# Altium schematic sheet uController.SchDoc
size A3; SheetNumber: 3; SheetTotal: 5
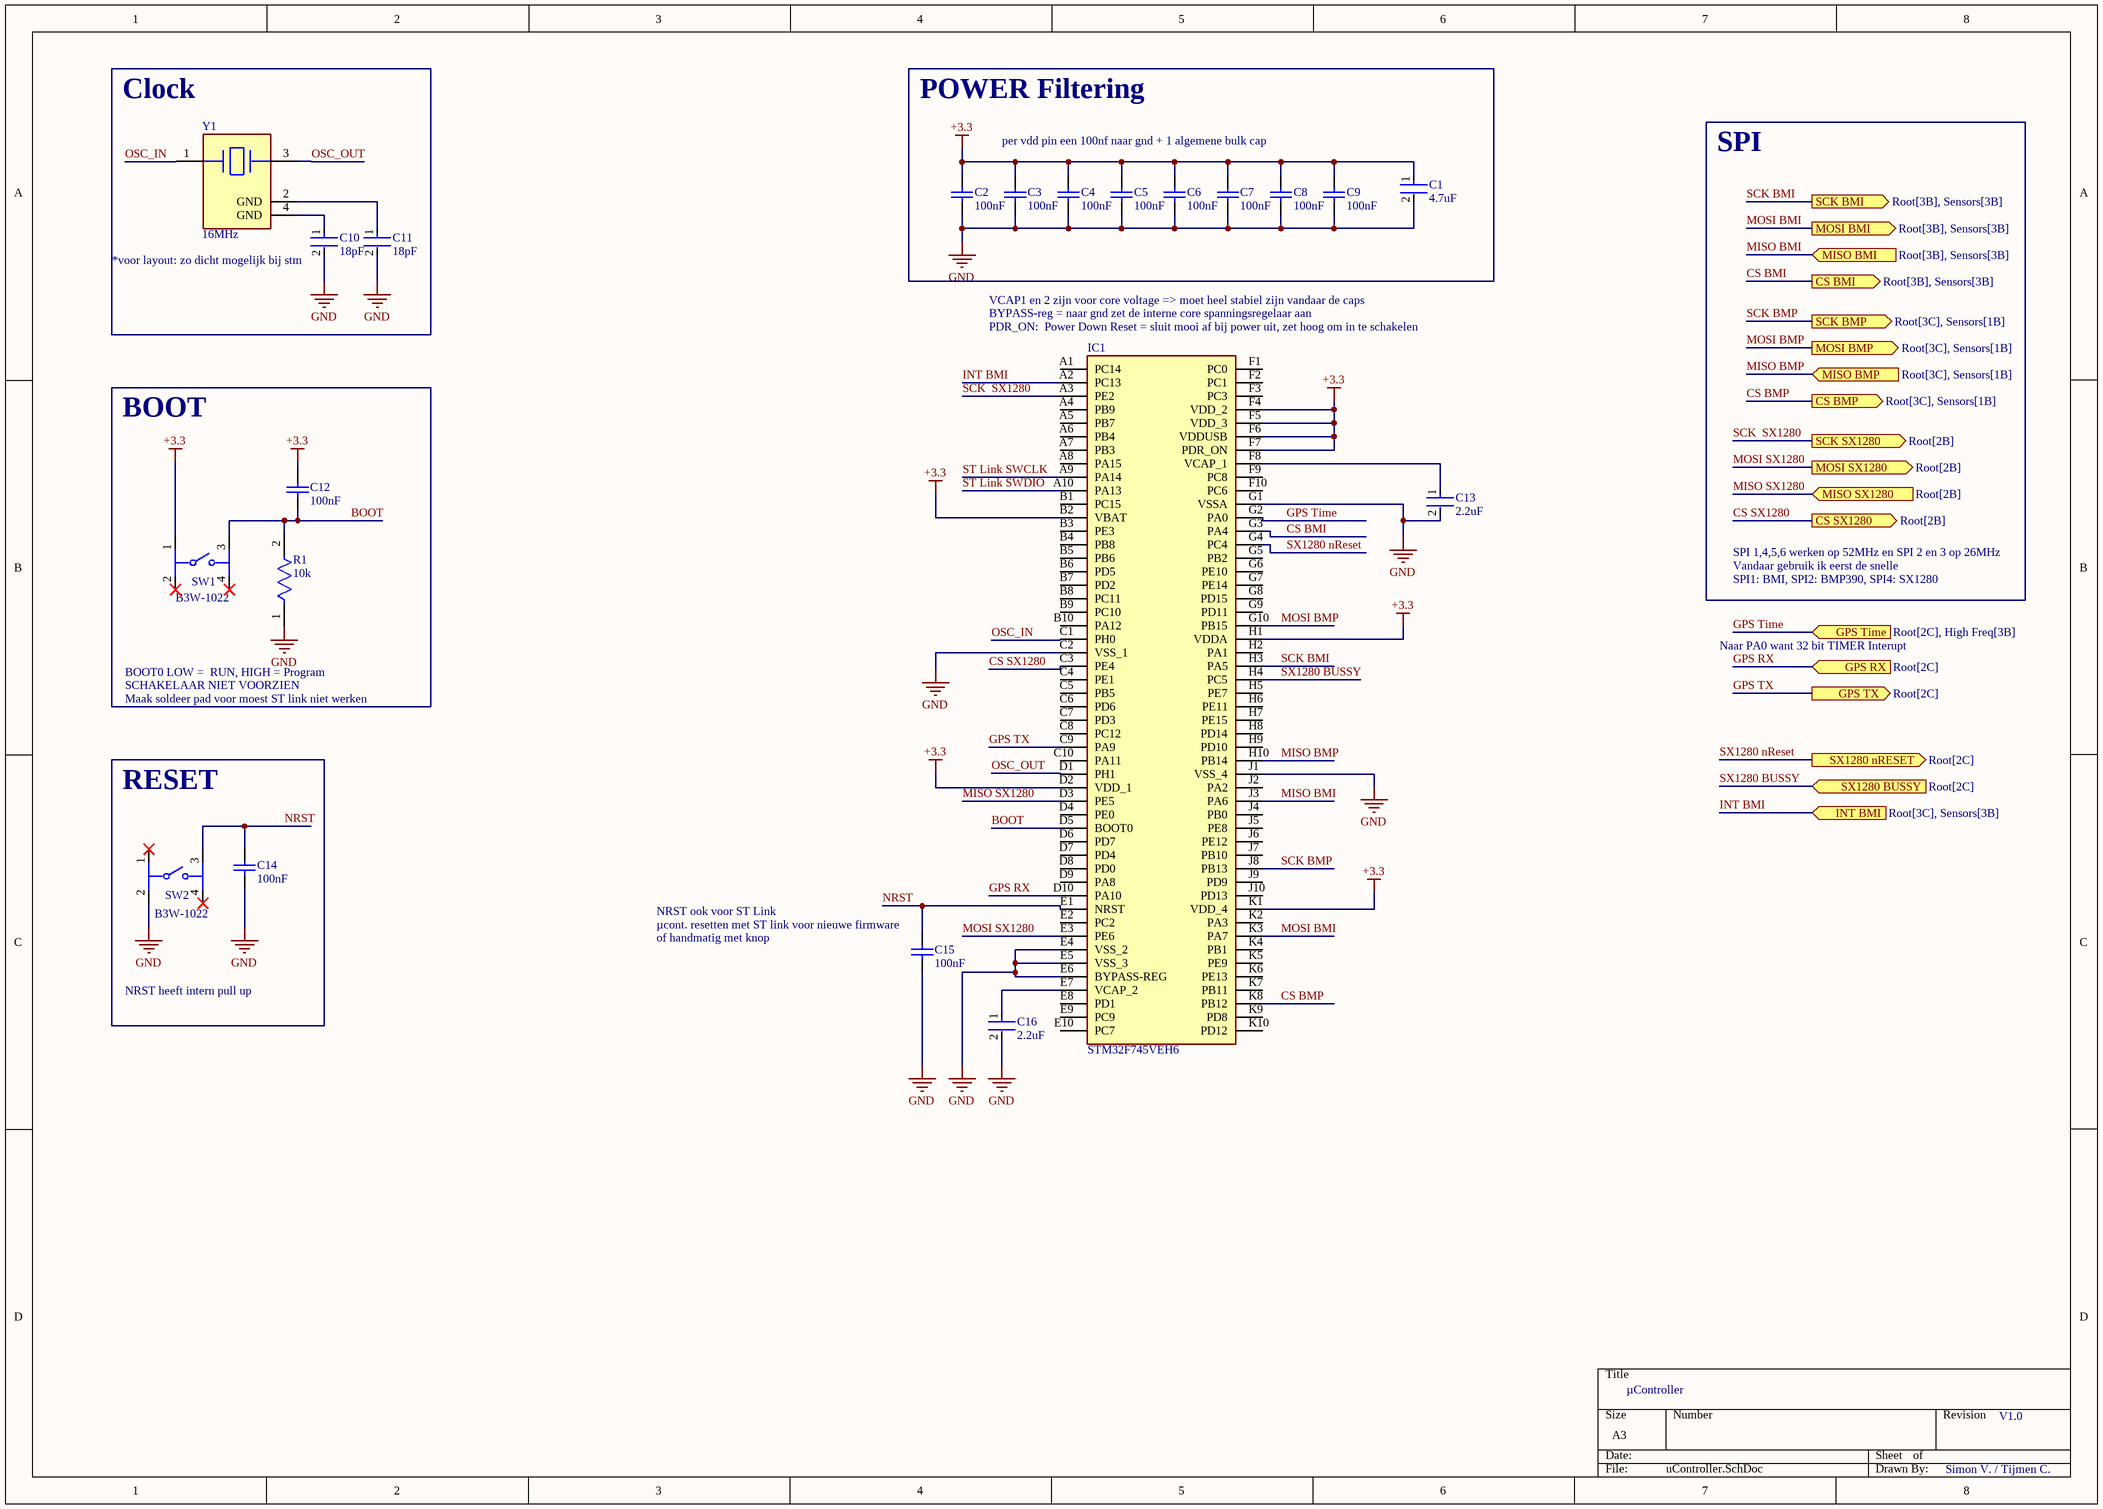
[diagram p0: uController.SchDoc]

## Parts
C1  4.7uF  [FP-CC0603-DC-MFG]
C2  100nF  [CAPC1608X92X38ML15T08]
C3  100nF  [CAPC1608X92X38ML15T08]
C4  100nF  [CAPC1608X92X38ML15T08]
C5  100nF  [CAPC1608X92X38ML15T08]
C6  100nF  [CAPC1608X92X38ML15T08]
C7  100nF  [CAPC1608X92X38ML15T08]
C8  100nF  [CAPC1608X92X38ML15T08]
C9  100nF  [CAPC1608X92X38ML15T08]
C10  18pF  [FP-C0603C-CF-MFG]
C11  18pF  [FP-C0603C-CF-MFG]
C12  100nF  [CAPC1608X92X38ML15T08]
C13  2.2uF  [FP-CC0603-DA-MFG]
C14  100nF  [CAPC1608X92X38ML15T08]
C15  100nF  [CAPC1608X92X38ML15T08]
C16  2.2uF  [FP-CC0603-DA-MFG]
IC1  STM32F745VEH6  [BGA100C80P10X10_800X800X110]
R1  10k  [FP-MCT0603-MFG]
SW1  B3W-1022  [FP-B3W-1022-MFG]
SW2  B3W-1022  [FP-B3W-1022-MFG]
Y1  16MHz  [FP-ABM8-MFG]

## Ports
CS BMI (out, see Root[3B], Sensors[3B]), CS BMP (out, see Root[3C], Sensors[1B]), CS SX1280 (out, see Root[2B]), GPS RX (in, see Root[2C]), GPS Time (in, see Root[2C], High Freq[3B]), GPS TX (out, see Root[2C]), INT BMI (in, see Root[3C], Sensors[3B]), MISO BMI (in, see Root[3B], Sensors[3B]), MISO BMP (in, see Root[3C], Sensors[1B]), MISO SX1280 (in, see Root[2B]), MOSI BMI (out, see Root[3B], Sensors[3B]), MOSI BMP (out, see Root[3C], Sensors[1B]), MOSI SX1280 (out, see Root[2B]), SCK BMI (out, see Root[3B], Sensors[3B]), SCK BMP (out, see Root[3C], Sensors[1B]), SCK SX1280 (out, see Root[2B]), SX1280 BUSSY (in, see Root[2C]), SX1280 nRESET (out, see Root[2C])

## Nets
+3.3: C1.1 C2.2 C3.2 C4.2 C5.2 C6.2 C7.2 C8.2 C9.2 C12.2 IC1.B2(VBAT) IC1.D2(VDD_1) IC1.F4(VDD_2) IC1.F5(VDD_3) IC1.F6(VDDUSB) IC1.F7(PDR_ON) IC1.H1(VDDA) IC1.K1(VDD_4) SW1.1
GND: C1.2 C2.1 C3.1 C4.1 C5.1 C6.1 C7.1 C8.1 C9.1 C10.2 C11.2 C13.2 C14.1 C15.1 C16.2 IC1.C2(VSS_1) IC1.E4(VSS_2) IC1.E5(VSS_3) IC1.E6(BYPASS-REG) IC1.G1(VSSA) IC1.J1(VSS_4) R1.1 SW2.2
BOOT: C12.1 IC1.D5(BOOT0) R1.2 SW1.3
CS BMI: IC1.G3(PA4) ; port CS BMI
CS BMP: IC1.K8(PB12) ; port CS BMP
CS SX1280: IC1.C3(PE4) ; port CS SX1280
GPS RX: IC1.D10(PA10) ; port GPS RX
GPS Time: IC1.G2(PA0) ; port GPS Time
GPS TX: IC1.C9(PA9) ; port GPS TX
INT BMI: IC1.A2(PC13) ; port INT BMI
MISO BMI: IC1.J3(PA6) ; port MISO BMI
MISO BMP: IC1.H10(PB14) ; port MISO BMP
MISO SX1280: IC1.D3(PE5) ; port MISO SX1280
MOSI BMI: IC1.K3(PA7) ; port MOSI BMI
MOSI BMP: IC1.G10(PB15) ; port MOSI BMP
MOSI SX1280: IC1.E3(PE6) ; port MOSI SX1280
NRST: C14.2 C15.2 IC1.E1(NRST) SW2.3
OSC_IN: IC1.C1(PH0) Y1.1
OSC_OUT: IC1.D1(PH1) Y1.3
SCK  SX1280: IC1.A3(PE2) ; port SCK SX1280
SCK BMI: IC1.H3(PA5) ; port SCK BMI
SCK BMP: IC1.J8(PB13) ; port SCK BMP
ST Link SWCLK: IC1.A9(PA14)
ST Link SWDIO: IC1.A10(PA13)
SX1280 BUSSY: IC1.H4(PC5) ; port SX1280 BUSSY
SX1280 nReset: IC1.G4(PC4) ; port SX1280 nRESET
NetC10_1: C10.1 Y1.4(GND)
NetC11_1: C11.1 Y1.2(GND)
NetC13_1: C13.1 IC1.F8(VCAP_1)
NetC16_1: C16.1 IC1.E7(VCAP_2)

Not connected (* = marked no-connect by the designer): IC1 A1(PC14) A4(PB9) A5(PB7) A6(PB4) A7(PB3) A8(PA15) B1(PC15) B3(PE3) B4(PB8) B5(PB6) B6(PD5) B7(PD2) B8(PC11) B9(PC10) B10(PA12) C4(PE1) C5(PB5) C6(PD6) C7(PD3) C8(PC12) C10(PA11) D4(PE0) D6(PD7) D7(PD4) D8(PD0) D9(PA8) E2(PC2) E8(PD1) E9(PC9) E10(PC7) F1(PC0) F2(PC1) F3(PC3) F9(PC8) F10(PC6) G5(PB2) G6(PE10) G7(PE14) G8(PD15) G9(PD11) H2(PA1) H5(PE7) H6(PE11) H7(PE15) H8(PD14) H9(PD10) J2(PA2) J4(PB0) J5(PE8) J6(PE12) J7(PB10) J9(PD9) J10(PD13) K2(PA3) K4(PB1) K5(PE9) K6(PE13) K7(PB11) K9(PD8) K10(PD12); SW1 2* 4*; SW2 1* 4*

## Notes on the sheet
- Clock
- POWER Filtering
- per vdd pin een 100nf naar gnd + 1 algemene bulk cap
- SPI
- (near C10) *voor layout: zo dicht mogelijk bij stm
- VCAP1 en 2 zijn voor core voltage => moet heel stabiel zijn vandaar de caps
- (near IC1) BYPASS-reg = naar gnd zet de interne core spanningsregelaar aan
- (near IC1) PDR_ON:  Power Down Reset = sluit mooi af bij power uit, zet hoog om in te schakelen
- BOOT
- SPI 1,4,5,6 werken op 52MHz en SPI 2 en 3 op 26MHz
- Vandaar gebruik ik eerst de snelle
- SPI1: BMI, SPI2: BMP390, SPI4: SX1280
- Naar PA0 want 32 bit TIMER Interupt
- BOOT0 LOW =  RUN, HIGH = Program
- SCHAKELAAR NIET VOORZIEN
- Maak soldeer pad voor moest ST link niet werken
- RESET
- NRST ook voor ST Link
- (near C15) µcont. resetten met ST link voor nieuwe firmware
- of handmatig met knop
- NRST heeft intern pull up
- µController
- V1.0
- Simon V. / Tijmen C.

## Library data of the parts
C1 = CMP-03422-001038-2: CAP CER 4.7UF 6.3V X7R 0603; Tolerance: 20%; RoHS Compliant: Yes; Packaging: Cut Tape; Mount: Surface Mount; Case Code (Imperial): 0603; Voltage Rating: 6.3V; Min Operating Temperature: -55°C; Case/Package: 0603; Case Code (Metric): 1608; Max Operating Temperature: 125°C; Capacitance: 4.7uF
C2-C9 C12 C14 C15 = CMP-2006-01140-1: Part Number: VJ0603Y104MXXAC; Manufacturer: Vitramon
C10 C11 = CMP-03020-018448-1: C0603 18 pF C0G 30ppm/°C 1.00% 50 V; Manufacturer: KEMET; Manufacturer Part Number: C0603C180F5GACAUTO; Voltage Rating: 50 V; Automotive Grade: Grade 1; Tolerance: 0.01; Material: Ceramic; Height: 0.87mm; Lead Free: Yes; Category: Cap; Capacitance: 18 pF; Temperature Characteristic: C0G; Device Class L3: Ceramic Capacitors; Package: C0603C-CF; ComponentLink2Description: Datasheet; Automotive: Yes; Temperature Range Low: -55°C; Device Class L1: Passive Components; ComponentLink2URL: https://api.kemet.com/component-edge/download/datasheet/C0603C100J5GACAUTO.pdf; Octopart: https://octopart.com/c0603c180f5gacauto-kemet-91893831; Value: 18 pF; Temperature: -55°C to +125°C; Temperature Range High: +125°C; Device Class L2: Capacitors; RoHS: TRUE; Temperature Coefficient: 30ppm/°C
C13 C16 = CMP-03422-000187-1: CC0603 2.2 uF X5R 10.00% 16 V; Manufacturer: YAGEO; Manufacturer Part Number: CC0603KPX5R7BB225; Voltage Rating: 16 V; Material: Ceramic; Tolerance: 0.1; Temperature Coefficient: 15%; ComponentLink2Description: Datasheet; Device Class L3: Ceramic Capacitors; Temperature Characteristic: X5R; Package: CC0603-DA; Automotive: No; Device Class L1: Passive Components; ComponentLink2URL: http://www.yageo.com/documents/recent/UPY-GPHC_X7R_6.3V-to-50V_18.pdf; Value: 2.2 uF; RoHS: TRUE; Height: 0.9mm; Temperature Range High: +125°C; Footprint Url: http://www.yageo.com/exep/pages/download/literatures/UPY-C_GEN_24.pdf; Lead Free: Yes; Temperature Range Low: -55°C; Capacitance: 2.2 uF; Octopart: https://octopart.com/cc0603kpx5r7bb225-yageo-91091799; Device Class L2: Capacitors; Voltage: 16 V; Temperature: -55°C to +125°C; Category: Cap
IC1 = STM32F745VEH6: Integrated Circuit; Manufacturer_Name: STMicroelectronics; Datasheet Link: https://www.st.com/resource/en/datasheet/stm32f745ie.pdf; Height: 1.1mm; Manufacturer_Part_Number: STM32F745VEH6; Mouser Part Number: 511-STM32F745VEH6; Mouser Price/Stock: https://www.mouser.co.uk/ProductDetail/STMicroelectronics/STM32F745VEH6?qs=dTJS0cRn7ogJy7Gdq90%252Bbw%3D%3D; Arrow Part Number: STM32F745VEH6; Arrow Price/Stock: https://www.arrow.com/en/products/stm32f745veh6/stmicroelectronics?region=nac
R1 = CMP-02407-002367-1: RES SMD 100 OHM 1% 1/8W 0603; Max Power Dissipation: 100mW; Temperature Coefficient: 15ppm/°C; Resistance: 10kR; Tolerance: 0.1%; Length: 0.061inch; Min Operating Temperature: -55°C; Case/Package: 0603; Max Operating Temperature: 125°C; Number of Terminations: 2; Packaging: Tape and Reel; Width: 0.033inch; Composition: Thin Film; Height: 0.022inch; Package Quantity: 1000
SW1 SW2 = CMP-08834-000055-1: SWITCH TACTILE SPST-NO 0.05A 24V; Operating Force: 230gf; Switch Function: Off-Mom; Switch Travel: 0.25mm; Throw Configuration: SPST; Actuator Type: Standard; Illumination Type: Non-Illuminated; Ratings: IP67; Mechanical Life: 1000000Cycles; Packaging: Bulk; Termination: PC Pin; Max Operating Temperature: 70°C; RoHS Compliant: Yes; Mount: Through Hole; Min Operating Temperature: -25°C
Y1 = CMP-27762-003067-1: Crystal 16MHz ±20ppm 18pF SMD-4 3.2mm x 2.5mm                      ABM8-16.000MHZ-B2-T3; Frequency Stability: 50ppm; ESR (Equivalent Series Resistance): 70R; Packaging: Tape and Reel; Load Capacitance: 18pF; Min Operating Temperature: -20°C; Case/Package: SMD/SMT; Length: 0.126inch; RoHS Compliant: Yes; Max Operating Temperature: 70°C; Width: 0.098inch; Series: ABM8; Frequency: 16MHz; Height: 0.031inch; Mount: Surface Mount; Frequency Tolerance: 20ppm